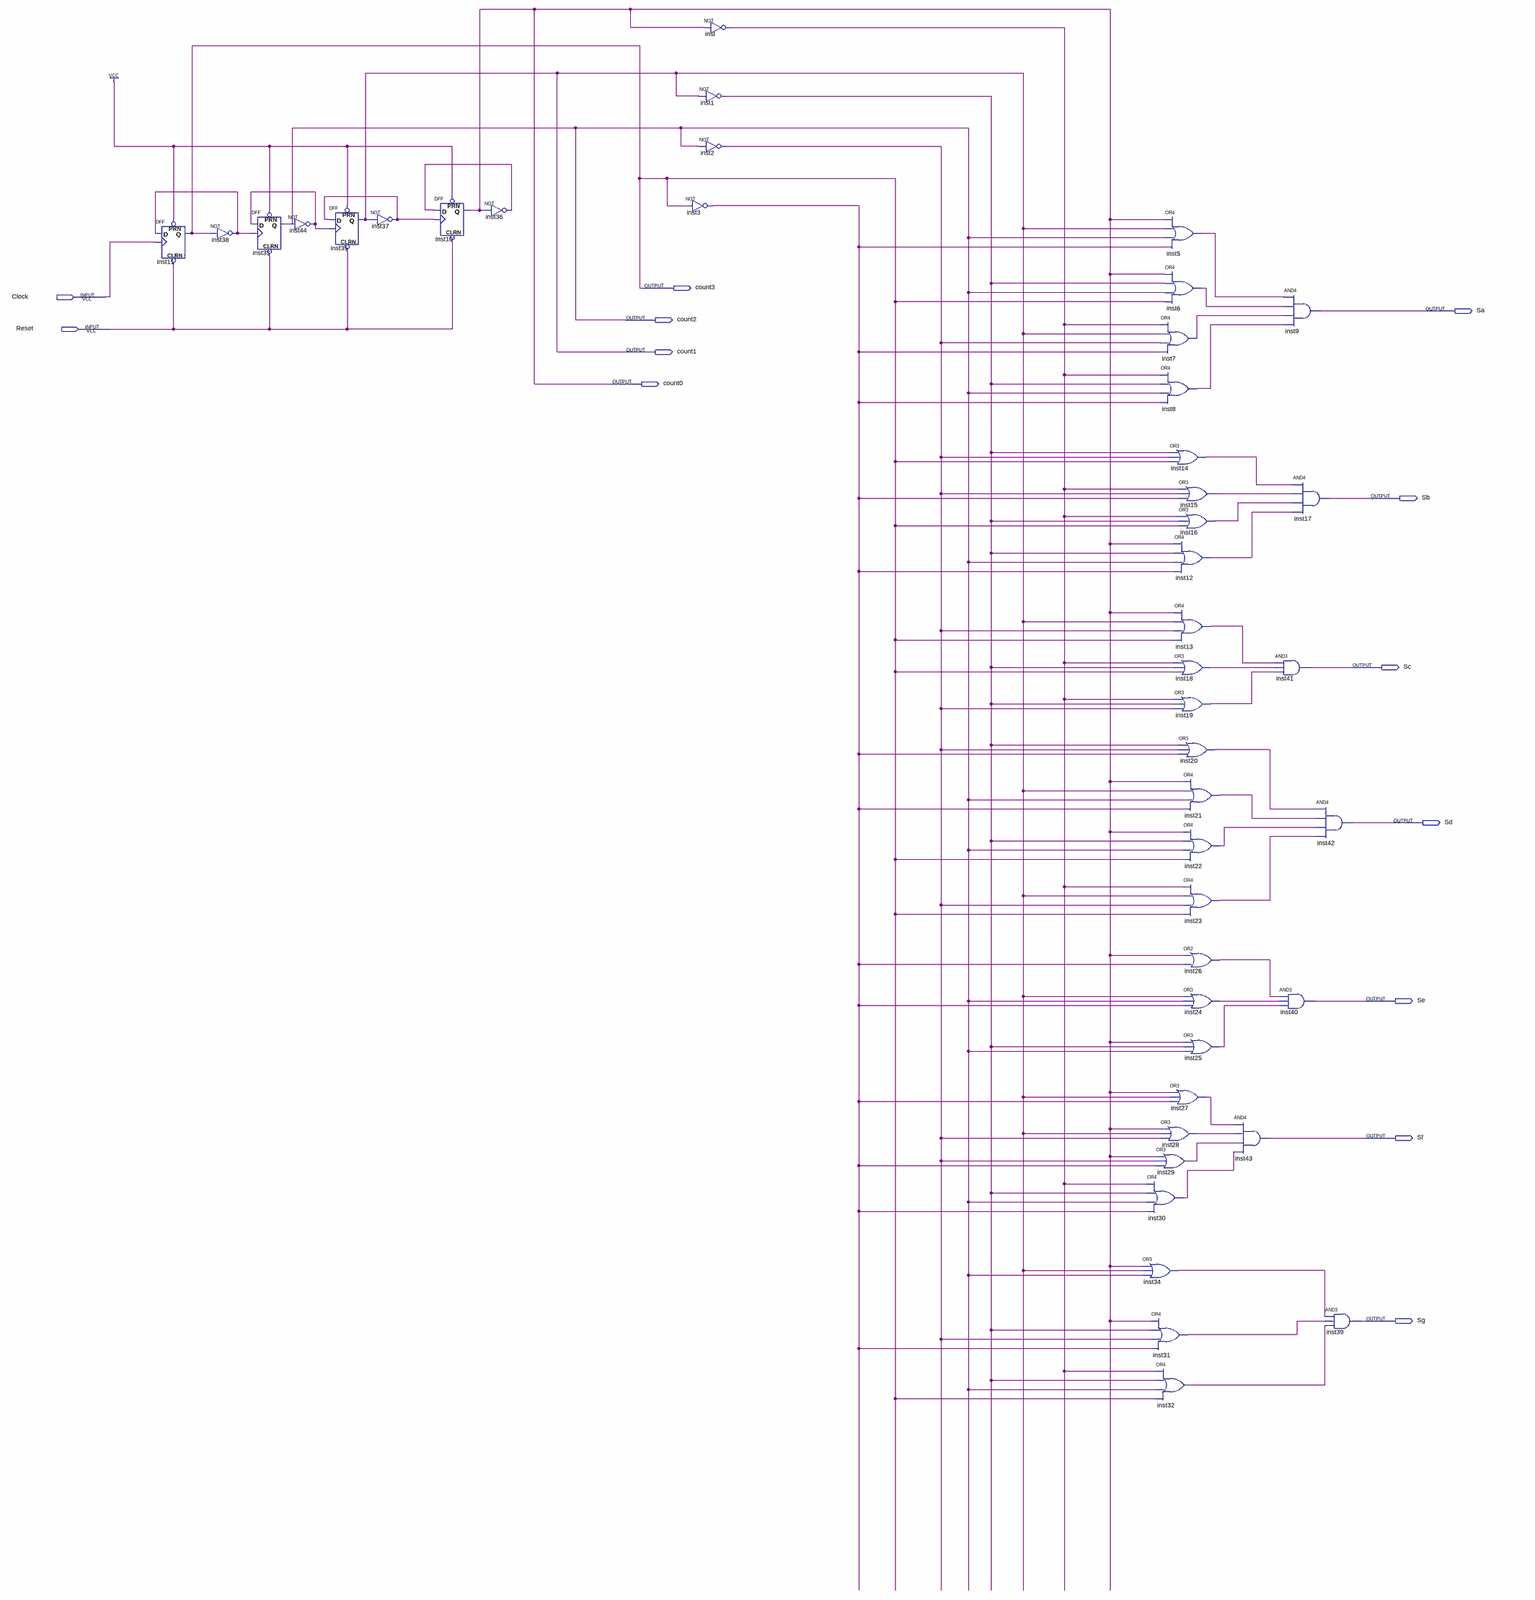
[diagram p0: schematic sheet, whole]
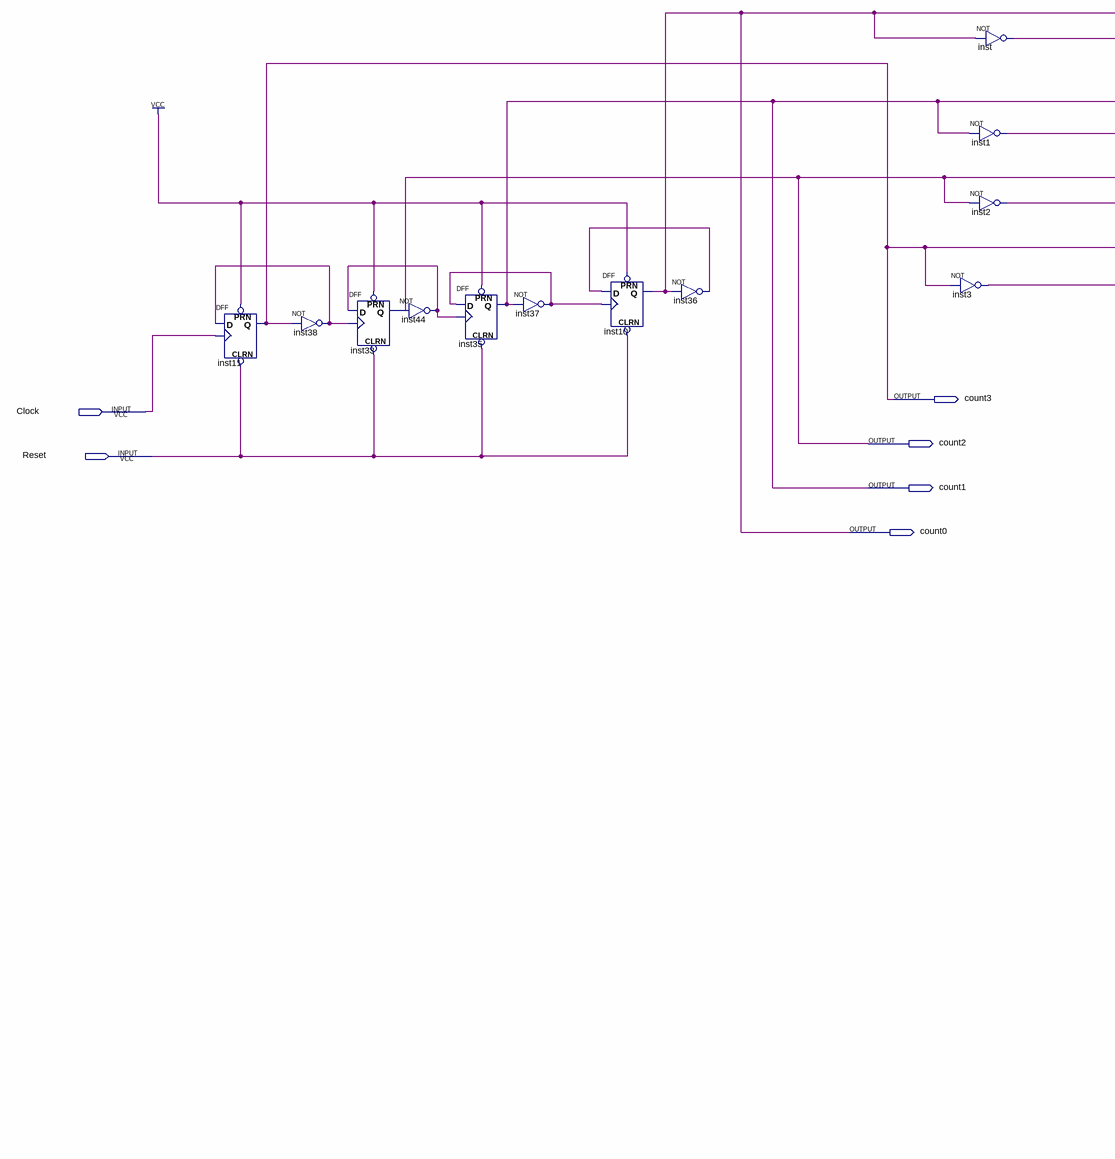
[diagram p1: schematic sheet, upper left part]
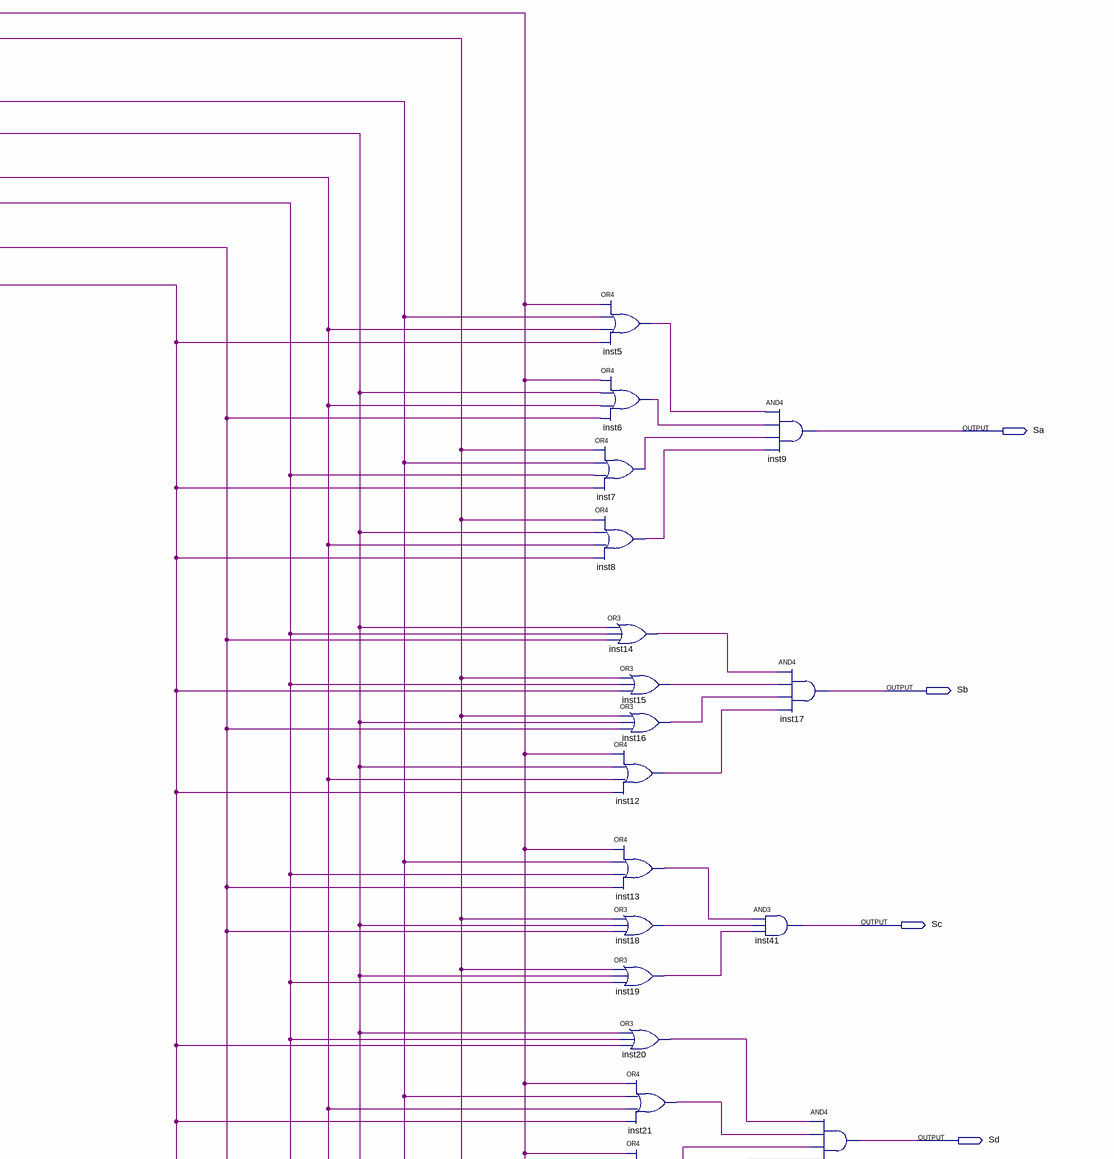
[diagram p2: schematic sheet, upper right part]
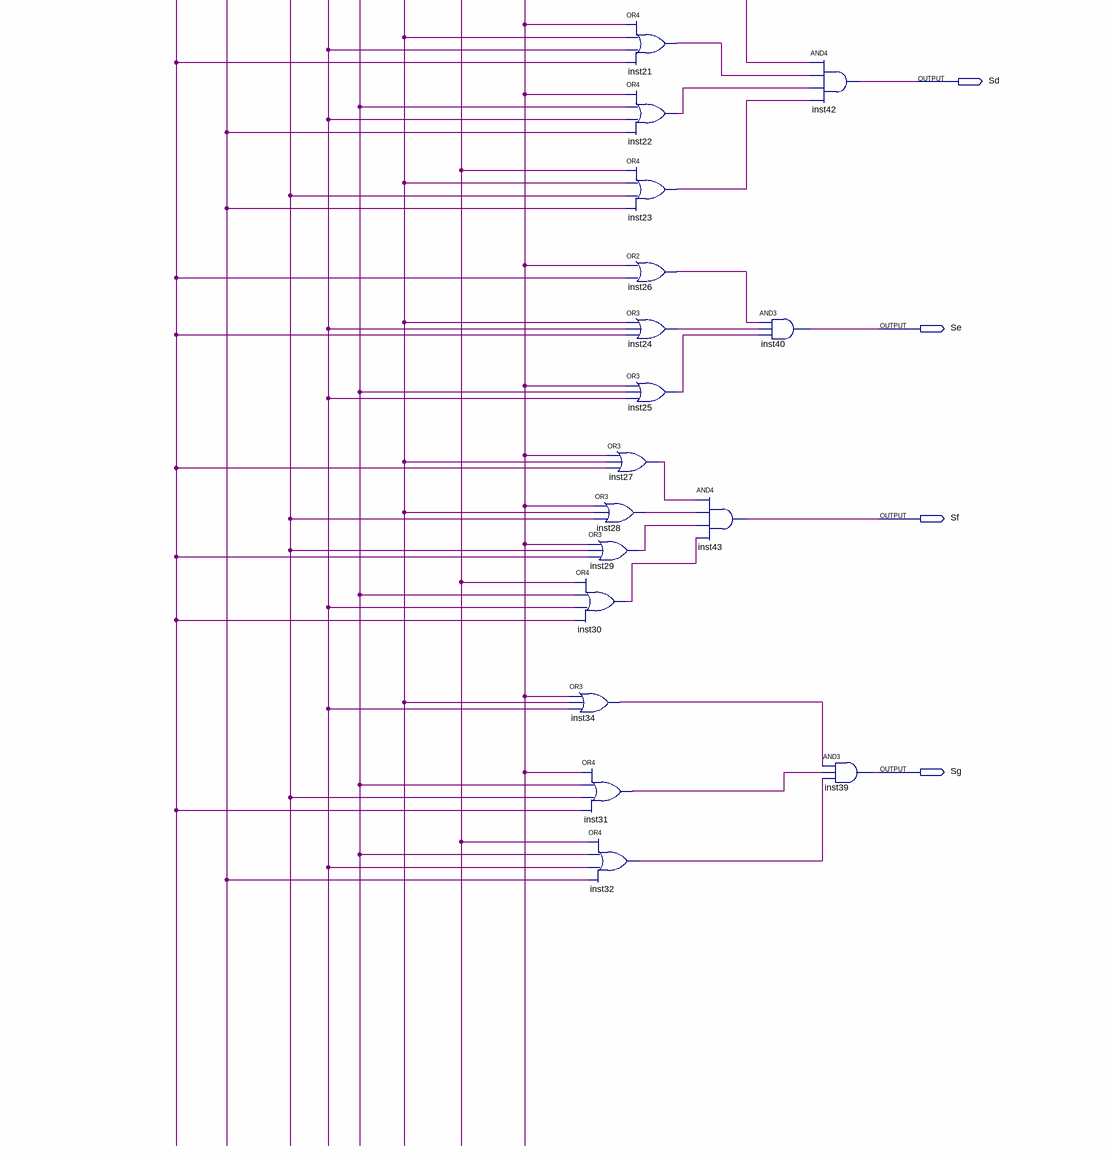
[diagram p3: schematic sheet, lower right part]
// Quartus schematic HD3.bdf as structural Verilog: 44 symbols, 13 pins
module HD3 (
  input  Clock,
  input  Reset,
  output count3,
  output Sa,
  output count2,
  output count1,
  output count0,
  output Sb,
  output Sc,
  output Sd,
  output Se,
  output Sf,
  output Sg
);

  wire inst1_out, inst2_out, inst3_out, inst5_out, inst6_out, inst7_out, inst8_out, inst12_out, inst13_out,
       inst14_out, inst15_out, inst16_out, inst18_out, inst19_out, inst20_out, inst21_out, inst22_out,
       inst23_out, inst24_out, inst25_out, inst26_out, inst27_out, inst28_out, inst29_out, inst30_out,
       inst31_out, inst32_out, inst34_out, inst36_out, inst37_out, inst38_out, inst44_out, inst_out;

  DFF inst11 (.CLRN(Reset), .CLK(Clock), .D(inst38_out), .PRN(1'b1), .Q(count3));
  not inst38 (inst38_out, count3);
  DFF inst33 (.CLRN(Reset), .CLK(inst38_out), .D(inst44_out), .PRN(1'b1), .Q(count2));
  not inst44 (inst44_out, count2);
  DFF inst35 (.CLRN(Reset), .CLK(inst44_out), .D(inst37_out), .PRN(1'b1), .Q(count1));
  not inst37 (inst37_out, count1);
  DFF inst10 (.CLRN(Reset), .CLK(inst37_out), .D(inst36_out), .PRN(1'b1), .Q(count0));
  not inst36 (inst36_out, count0);
  not inst3 (inst3_out, count3);
  not inst (inst_out, count0);
  not inst1 (inst1_out, count1);
  not inst2 (inst2_out, count2);
  or inst5 (inst5_out, count0, count1, count2, inst3_out);
  or inst6 (inst6_out, count0, inst1_out, count2, count3);
  or inst7 (inst7_out, inst_out, count1, inst2_out, inst3_out);
  or inst8 (inst8_out, inst_out, inst1_out, count2, inst3_out);
  or inst14 (inst14_out, inst1_out, inst2_out, count3);
  or inst27 (inst27_out, count0, count1, inst3_out);
  or inst28 (inst28_out, count0, count1, inst2_out);
  or inst29 (inst29_out, count0, inst2_out, inst3_out);
  or inst30 (inst30_out, inst_out, inst1_out, count2, inst3_out);
  or inst34 (inst34_out, count0, count1, count2);
  or inst31 (inst31_out, count0, inst1_out, inst2_out, inst3_out);
  or inst32 (inst32_out, inst_out, inst1_out, count2, count3);
  or inst15 (inst15_out, inst_out, inst2_out, inst3_out);
  or inst16 (inst16_out, inst_out, inst1_out, count3);
  or inst12 (inst12_out, count0, inst1_out, count2, inst3_out);
  or inst13 (inst13_out, count0, count1, inst2_out, count3);
  or inst18 (inst18_out, inst_out, inst1_out, count3);
  or inst19 (inst19_out, inst_out, inst1_out, inst2_out);
  or inst20 (inst20_out, inst1_out, inst2_out, inst3_out);
  or inst21 (inst21_out, count0, count1, count2, inst3_out);
  or inst22 (inst22_out, count0, inst1_out, count2, count3);
  or inst23 (inst23_out, inst_out, count1, inst2_out, count3);
  or inst26 (inst26_out, count0, inst3_out);
  or inst24 (inst24_out, count1, count2, inst3_out);
  or inst25 (inst25_out, count0, inst1_out, count2);
  and inst43 (Sf, inst27_out, inst28_out, inst29_out, inst30_out);
  and inst41 (Sc, inst13_out, inst18_out, inst19_out);
  and inst40 (Se, inst26_out, inst24_out, inst25_out);
  and inst9 (Sa, inst5_out, inst6_out, inst7_out, inst8_out);
  and inst17 (Sb, inst14_out, inst15_out, inst16_out, inst12_out);
  and inst42 (Sd, inst20_out, inst21_out, inst22_out, inst23_out);
  and inst39 (Sg, inst34_out, inst31_out, inst32_out);
endmodule
